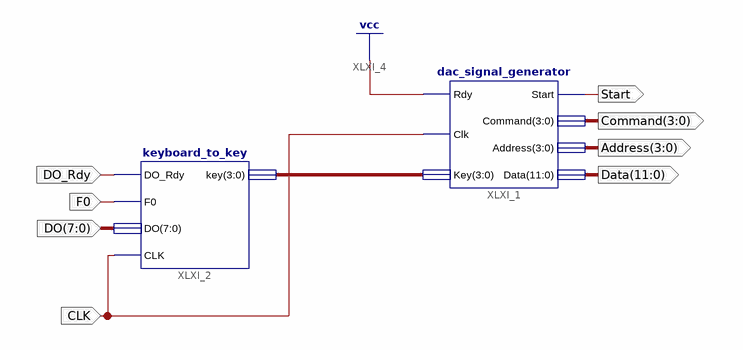
[diagram p0: schematic sheet 1]
// Xilinx ISE schematic raw_main.sch (spartan3e) as structural Verilog: 2 symbols, 8 ports
module raw_main (
  input  CLK,
  input  DO_Rdy,
  input  F0,
  input  [7:0] DO,
  output Start,
  output [3:0] Command,
  output [3:0] Address,
  output [11:0] Data
);

  wire [3:0] XLXN_1;

  dac_signal_generator XLXI_1 (
    .Rdy(1'b1), .Clk(CLK), .Key(XLXN_1), .Start(Start), .Command(Command), .Address(Address), .Data(Data));
  keyboard_to_key XLXI_2 (.DO_Rdy(DO_Rdy), .F0(F0), .DO(DO), .key(XLXN_1), .CLK(CLK));
endmodule
